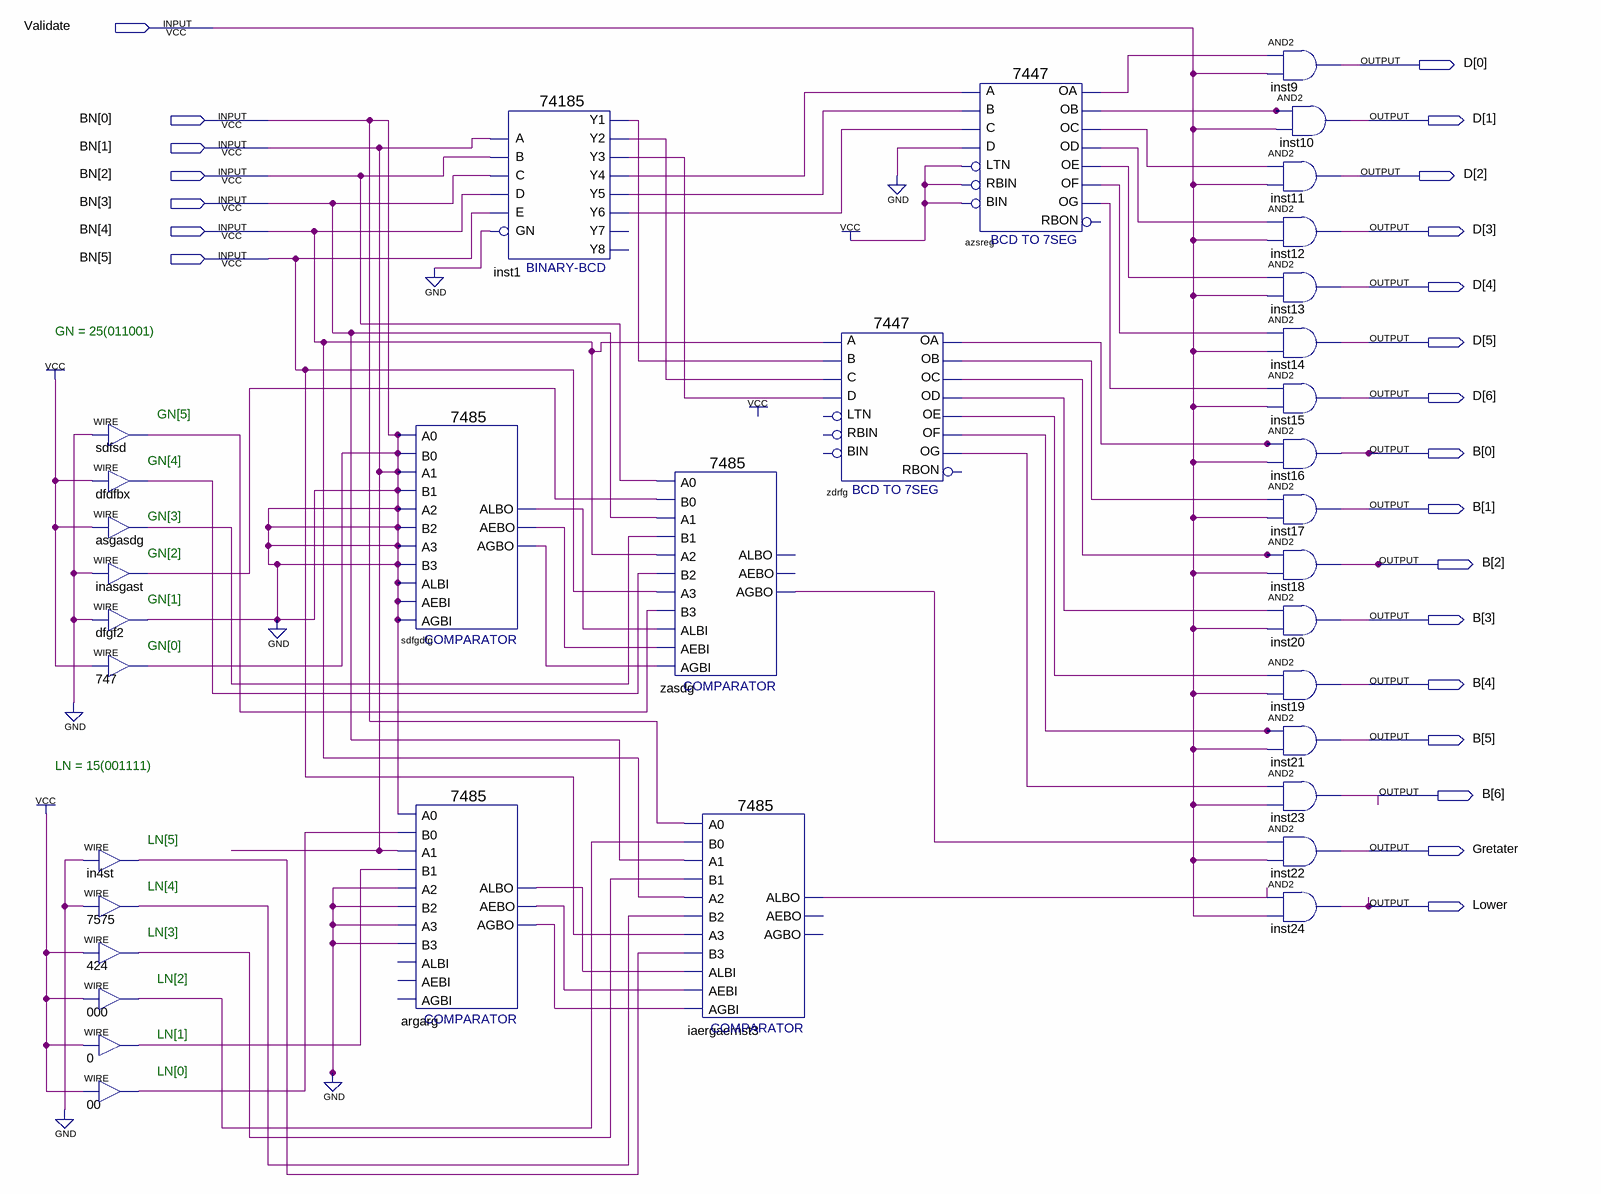
[diagram p0: schematic sheet]
// Quartus schematic practica2.bdf as structural Verilog: 35 symbols, 23 pins
module practica2 (
  input  Validate,
  input  [5:0] BN,
  output [6:0] D,
  output [6:0] B,
  output Gretater,
  output Lower
);

  wire argarg_aebo, argarg_agbo, argarg_albo, asgasdg_out, azsreg_oa, azsreg_ob, azsreg_oc, azsreg_od,
       azsreg_oe, azsreg_of, azsreg_og, dfdfbx_out, iaergaernst3_albo, in4st_out, inasgast_out, inst1_y1,
       inst1_y2, inst1_y3, inst1_y4, inst1_y5, inst1_y6, n00_out, n0_out, n000_out, n424_out, n7575_out,
       sdfgdfg_aebo, sdfgdfg_agbo, sdfgdfg_albo, sdfsd_out, zasdg_agbo, zdrfg_oa, zdrfg_ob, zdrfg_oc,
       zdrfg_od, zdrfg_oe, zdrfg_of, zdrfg_og;

  assign sdfsd_out = 1'b0;  // WIRE sdfsd
  assign dfdfbx_out = 1'b1;  // WIRE dfdfbx
  assign asgasdg_out = 1'b1;  // WIRE asgasdg
  assign inasgast_out = 1'b0;  // WIRE inasgast
  assign BN[1] = 1'b0;  // WIRE dfgf2
  assign BN[1] = 1'b1;  // WIRE 747
  assign in4st_out = 1'b0;  // WIRE in4st
  assign n7575_out = 1'b0;  // WIRE 7575
  assign n424_out = 1'b1;  // WIRE 424
  assign n000_out = 1'b1;  // WIRE 000
  assign n0_out = 1'b1;  // WIRE 0
  assign n00_out = 1'b1;  // WIRE 00
  \7485  sdfgdfg (
    .A3(BN[1]), .B2(BN[1]), .A2(BN[1]), .AEBI(BN[1]), .AGBI(BN[1]), .ALBI(BN[1]), .A0(BN[1]), .B0(BN[1]),
    .B3(BN[1]), .A1(BN[1]), .B1(BN[1]), .ALBO(sdfgdfg_albo), .AGBO(sdfgdfg_agbo), .AEBO(sdfgdfg_aebo));
  \7485  argarg (
    .A3(1'b0), .B2(1'b0), .A2(1'b0), .A0(BN[1]), .B0(n00_out), .B3(1'b0), .A1(BN[1]), .B1(n0_out),
    .ALBO(argarg_albo), .AGBO(argarg_agbo), .AEBO(argarg_aebo));  // open: AEBI, AGBI, ALBI
  \74185  inst1 (
    .A(BN[1]), .B(BN[2]), .D(BN[4]), .C(BN[3]), .E(BN[5]), .GN(1'b0), .Y1(inst1_y1), .Y3(inst1_y3),
    .Y2(inst1_y2), .Y5(inst1_y5), .Y4(inst1_y4), .Y6(inst1_y6));  // open: Y8, Y7
  \7485  zasdg (
    .A3(BN[5]), .B2(dfdfbx_out), .A2(BN[4]), .AEBI(sdfgdfg_aebo), .AGBI(sdfgdfg_agbo), .ALBI(sdfgdfg_albo),
    .A0(BN[2]), .B0(inasgast_out), .B3(sdfsd_out), .A1(BN[3]), .B1(asgasdg_out), .AGBO(zasdg_agbo));  // open: ALBO, AEBO
  \7485  iaergaernst3 (
    .A3(BN[5]), .B2(n7575_out), .A2(BN[4]), .AEBI(argarg_aebo), .AGBI(argarg_agbo), .ALBI(argarg_albo),
    .A0(BN[1]), .B0(n000_out), .B3(in4st_out), .A1(BN[3]), .B1(n424_out), .ALBO(iaergaernst3_albo));  // open: AGBO, AEBO
  \7447  zdrfg (
    .B(inst1_y1), .C(inst1_y2), .D(inst1_y3), .A(BN[4]), .OB(zdrfg_ob), .OC(zdrfg_oc), .OE(zdrfg_oe),
    .OD(zdrfg_od), .OF(zdrfg_of), .OG(zdrfg_og), .OA(zdrfg_oa));  // open: LTN, RBIN, BIN, RBON
  \7447  azsreg (
    .LTN(1'b1), .B(inst1_y5), .C(inst1_y6), .D(1'b0), .RBIN(1'b1), .BIN(1'b1), .A(inst1_y4), .OB(azsreg_ob),
    .OC(azsreg_oc), .OE(azsreg_oe), .OD(azsreg_od), .OF(azsreg_of), .OG(azsreg_og), .OA(azsreg_oa));  // open: RBON
  and inst9 (D[0], azsreg_oa, Validate);
  and inst10 (D[1], azsreg_ob, Validate);
  and inst11 (D[2], azsreg_oc, Validate);
  and inst12 (D[3], azsreg_od, Validate);
  and inst13 (D[4], azsreg_oe, Validate);
  and inst14 (D[5], azsreg_of, Validate);
  and inst15 (D[6], azsreg_og, Validate);
  and inst16 (B[0], zdrfg_oa, Validate);
  and inst17 (B[1], zdrfg_ob, Validate);
  and inst18 (B[2], zdrfg_oc, Validate);
  and inst20 (B[3], zdrfg_od, Validate);
  and inst19 (B[4], zdrfg_oe, Validate);
  and inst21 (B[5], zdrfg_of, Validate);
  and inst23 (B[6], zdrfg_og, Validate);
  and inst22 (Gretater, zasdg_agbo, Validate);
  and inst24 (Lower, iaergaernst3_albo, Validate);

  assign BN[0] = BN[1];
  // also tied to GND on the sheet: BN[1]

  // Notes on the sheet:
  //   GN = 25(011001)
  //   GN[5]
  //   GN[4]
  //   GN[3]
  //   GN[2]
  //   GN[1]
  //   GN[0]
  //   LN = 15(001111)
  //   LN[5]
  //   LN[4]
  //   LN[3]
  //   LN[2]
  //   LN[1]
  //   LN[0]
endmodule
